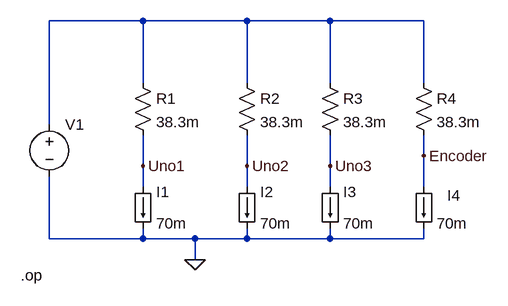
[diagram p0: schematic ExternalPowerSystem.asc]
ExternalPowerSystem.asc, the LTspice schematic file:
Version 4
SHEET 1 1040 680
WIRE 352 -96 208 -96
WIRE 512 -96 352 -96
WIRE 640 -96 512 -96
WIRE 784 -96 640 -96
WIRE 352 0 352 -96
WIRE 512 0 512 -96
WIRE 640 0 640 -96
WIRE 784 0 784 -96
WIRE 208 64 208 -96
WIRE 784 112 784 80
WIRE 352 128 352 80
WIRE 512 128 512 80
WIRE 640 128 640 80
WIRE 352 160 352 128
WIRE 512 160 512 128
WIRE 640 160 640 128
WIRE 784 160 784 112
WIRE 208 240 208 144
WIRE 352 240 352 224
WIRE 352 240 208 240
WIRE 432 240 352 240
WIRE 512 240 512 224
WIRE 512 240 432 240
WIRE 640 240 640 224
WIRE 640 240 512 240
WIRE 784 240 784 224
WIRE 784 240 640 240
WIRE 432 272 432 240
FLAG 432 272 0
FLAG 352 128 Uno1
FLAG 512 128 Uno2
FLAG 640 128 Uno3
FLAG 784 112 Encoder
SYMBOL voltage 208 48 R0
WINDOW 3 24 44 Left 2
WINDOW 123 0 0 Left 0
WINDOW 39 0 0 Left 0
SYMATTR InstName V1
SYMATTR Value ""
SYMBOL load 336 160 R0
WINDOW 123 0 0 Left 0
WINDOW 39 0 0 Left 0
SYMATTR InstName I1
SYMATTR Value 70m
SYMBOL load 496 160 R0
WINDOW 123 0 0 Left 0
WINDOW 39 0 0 Left 0
SYMATTR InstName I2
SYMATTR Value 70m
SYMBOL load 624 160 R0
WINDOW 123 0 0 Left 0
WINDOW 39 0 0 Left 0
SYMATTR InstName I3
SYMATTR Value 70m
SYMBOL load 768 160 R0
WINDOW 0 52 13 Left 2
WINDOW 123 0 0 Left 0
WINDOW 39 0 0 Left 0
SYMATTR InstName I4
SYMATTR Value 70m
SYMBOL res 336 -16 R0
SYMATTR InstName R1
SYMATTR Value 38.3m
SYMBOL res 496 -16 R0
SYMATTR InstName R2
SYMATTR Value 38.3m
SYMBOL res 624 -16 R0
SYMATTR InstName R3
SYMATTR Value 38.3m
SYMBOL res 768 -16 R0
SYMATTR InstName R4
SYMATTR Value 38.3m
TEXT 164 296 Left 2 !.op

The netlist it stands for:
* ExternalPowerSystem.asc
V1 N001 0
I1 Uno1 0 70m
I2 Uno2 0 70m
I3 Uno3 0 70m
I4 Encoder 0 70m
R1 N001 Uno1 38.3m
R2 N001 Uno2 38.3m
R3 N001 Uno3 38.3m
R4 N001 Encoder 38.3m
.op
.backanno
.end